# EAGLE design SilentStepStick-TMC5160_v14 (EAGLE 7.7.0)
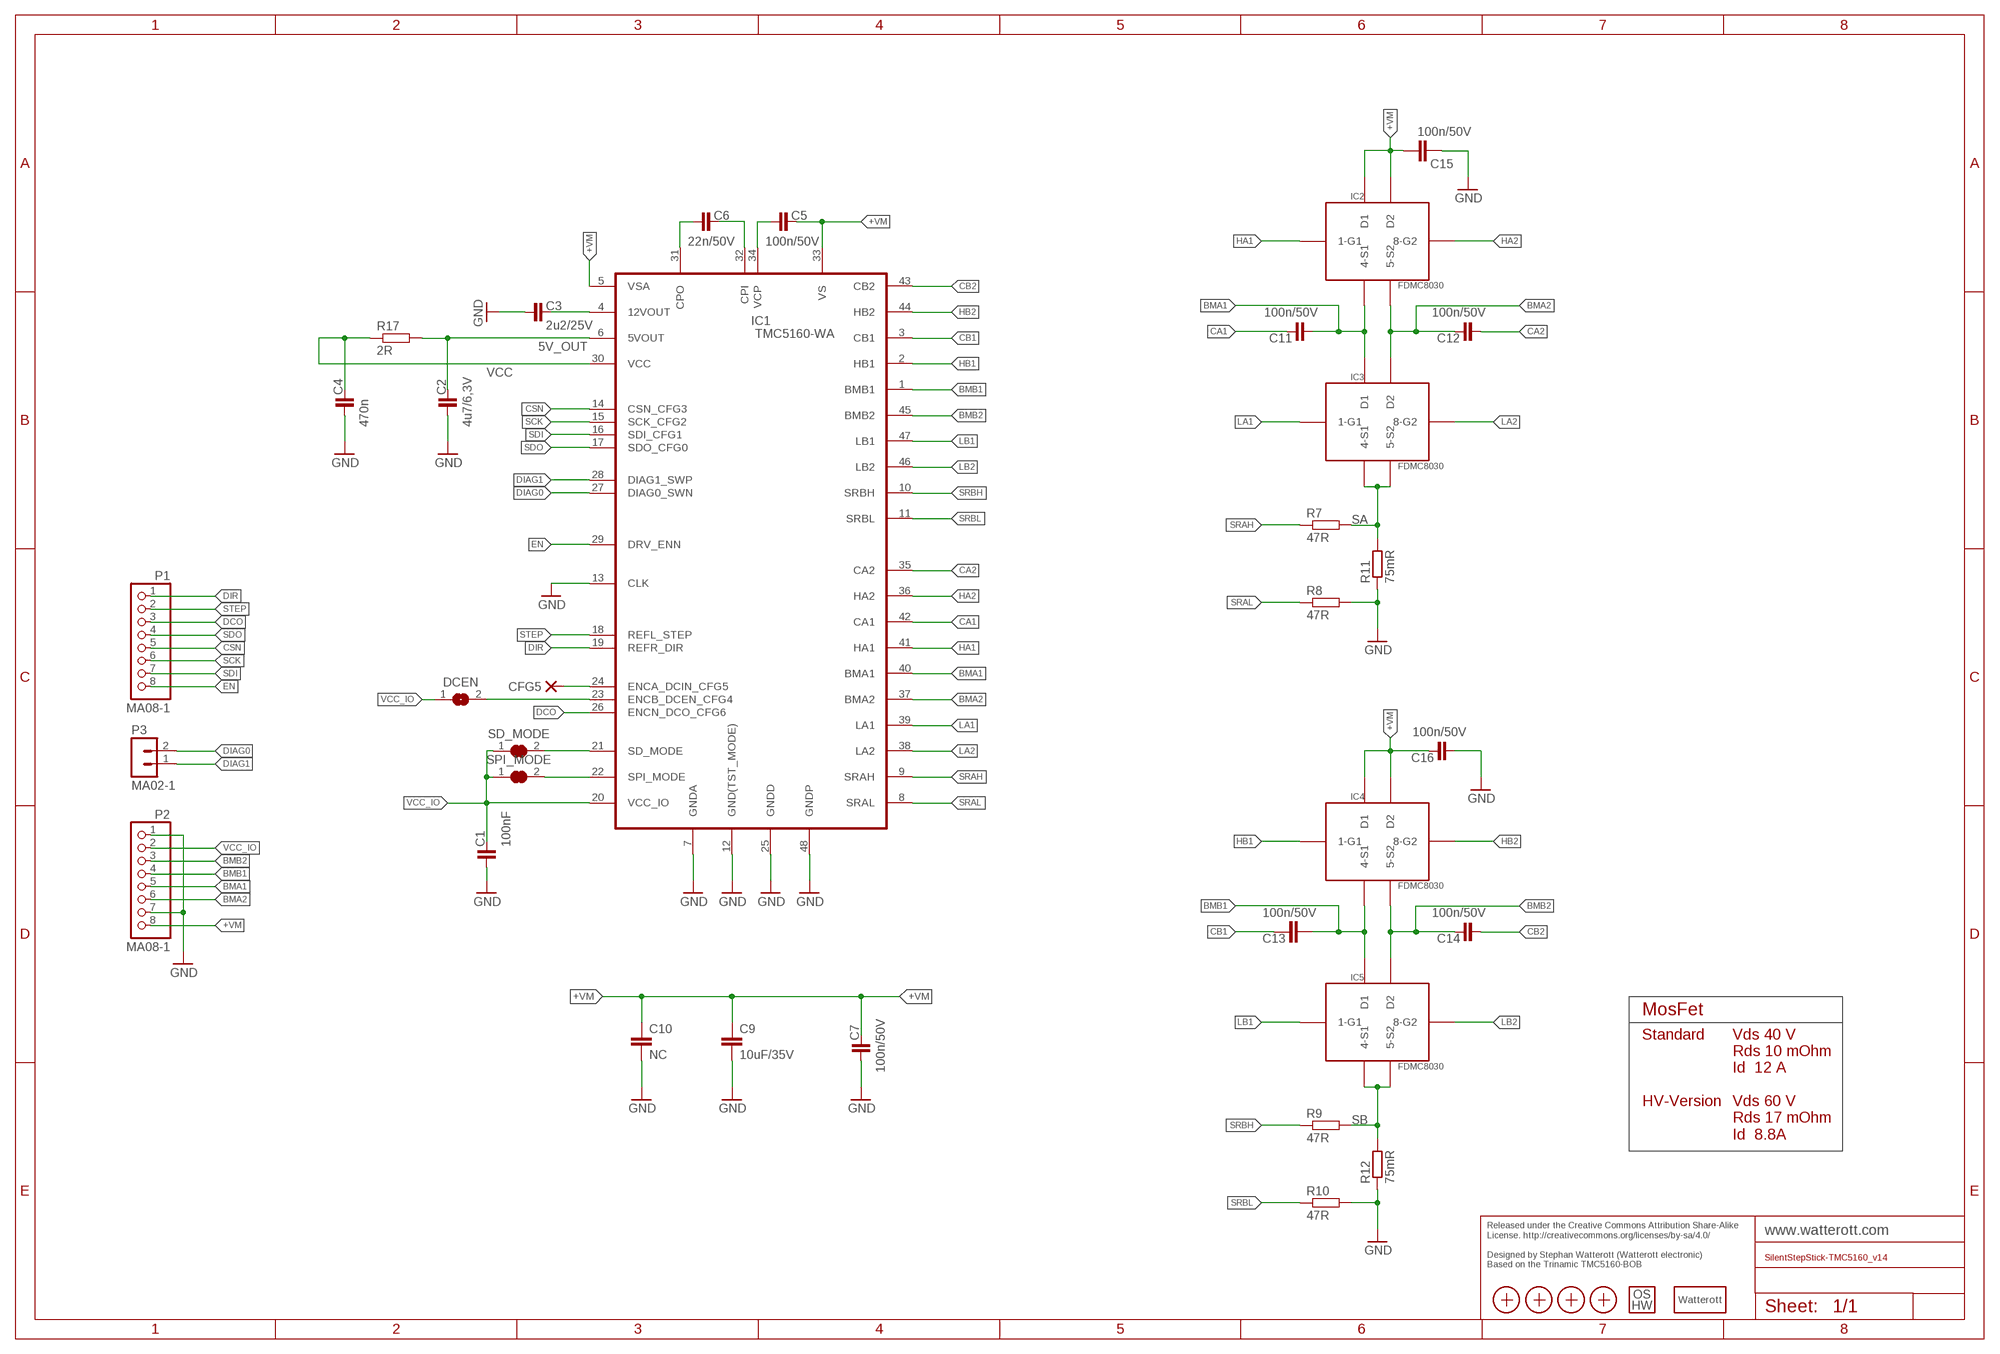
[diagram p0: schematic, sheet 1]

## Parts
C1  100nF  CAPACITOR-0402  [C0402]
C2  4u7/6,3V  CAPACITOR-0402  [C0402]
C3  2u2/25V  CAPACITOR-0402  [C0402]
C4  470n  CAPACITOR-0402  [C0402]
C5  100n/50V  CAPACITOR-0402  [C0402]
C6  22n/50V  CAPACITOR-0402  [C0402]
C7  100n/50V  CAPACITOR-0402  [C0402]
C9  10uF/35V  C-EUC0805  [C0805]
C10  NC  C-EUC0805  [C0805]
C11  100n/50V  CAPACITOR-0402  [C0402]
C12  100n/50V  CAPACITOR-0402  [C0402]
C13  100n/50V  C-EUC0402  [C0402]
C14  100n/50V  CAPACITOR-0402  [C0402]
C15  100n/50V  C-EUC0402  [C0402]
C16  100n/50V  CAPACITOR-0402  [C0402]
CFG5  PAD-0.7_NC  [PAD-0.7_NC]
DCEN  JUMPER2-0402-NC  [JUMPER2-0402_NC]
IC1  TMC5160-WA  TMC5160-WA  [VQFN56(47)_8.0X8.0X0.9MM_0.5P_EP]
IC2  FDMC8030  [8-POWERWDFN]
IC3  FDMC8030  [8-POWERWDFN]
IC4  FDMC8030  [8-POWERWDFN]
IC5  FDMC8030  [8-POWERWDFN]
LOGO1  LOGO_SPARK-2  [SPARK_2MM]
LOGO2  LOGO_OSHW-2  [OSHW_2MM]
P1  MA08-1  PINHD-1X08_2.54-S  [1X08-S]
P2  MA08-1  PINHD-1X08_2.54-S  [1X08-S]
P3  MA02-1  [MA02-1]
R7  47R  RESISTOR-0402  [C0402]
R8  47R  RESISTOR-0402  [C0402]
R9  47R  RESISTOR-0402  [C0402]
R10  47R  RESISTOR-0402  [C0402]
R11  75mR  R-EU_R1206  [R1206]
R12  75mR  R-EU_R1206  [R1206]
R17  2R  RESISTOR-0402  [C0402]
SD_MODE  JUMPER2-0402-NC  [JUMPER2-0402_NC]
SPI_MODE  JUMPER2-0402-NC  [JUMPER2-0402_NC]
X1  PASSER-04  [PASSER_04MM]
X2  PASSER-04  [PASSER_04MM]
X3  PASSER-04  [PASSER_04MM]
X4  PASSER-04  [PASSER_04MM]

## Nets
5V_OUT: C2.2 IC1.6(5VOUT) R17.2
12VOUT: C3.2 IC1.4(12VOUT)
+VM: C5.2 C7.2 C9.1 C10.1 C15.2 C16.2 IC1.5(VSA) IC1.33(VS) IC2.P$D1(D1) IC2.P$D2(D2) IC4.P$D1(D1) IC4.P$D2(D2) P2.8
BMA1: C11.1 IC1.40(BMA1) IC2.P$4(4-S1) IC3.P$D1(D1) P2.5
BMA2: C12.2 IC1.37(BMA2) IC2.P$5(5-S2) IC3.P$D2(D2) P2.6
BMB1: C13.1 IC1.1(BMB1) IC4.P$4(4-S1) IC5.P$D1(D1) P2.4
BMB2: C14.2 IC1.45(BMB2) IC4.P$5(5-S2) IC5.P$D2(D2) P2.3
CA1: C11.2 IC1.42(CA1)
CA2: C12.1 IC1.35(CA2)
CB1: C13.2 IC1.3(CB1)
CB2: C14.1 IC1.43(CB2)
CSN: IC1.14(CSN_CFG3) P1.5
DCEN: DCEN.2 IC1.23(ENCB_DCEN_CFG4)
DCIN: CFG5.1(P) IC1.24(ENCA_DCIN_CFG5)
DCO: IC1.26(ENCN_DCO_CFG6) P1.3
DIAG0: IC1.27(DIAG0_SWN) P3.2
DIAG1: IC1.28(DIAG1_SWP) P3.1
DIR: IC1.19(REFR_DIR) P1.1
EN: IC1.29(DRV_ENN) P1.8
GND: C1.1 C2.1 C3.1 C4.1 C7.1 C9.2 C10.2 C15.1 C16.1 IC1.7(GNDA) IC1.12(GND(TST_MODE)) IC1.13(CLK) IC1.25(GNDD) IC1.48(GNDP) P2.1 P2.7 R8.2 R10.2 R11.1 R12.1
HA1: IC1.41(HA1) IC2.P$1(1-G1)
HA2: IC1.36(HA2) IC2.P$8(8-G2)
HB1: IC1.2(HB1) IC4.P$1(1-G1)
HB2: IC1.44(HB2) IC4.P$8(8-G2)
LA1: IC1.39(LA1) IC3.P$1(1-G1)
LA2: IC1.38(LA2) IC3.P$8(8-G2)
LB1: IC1.47(LB1) IC5.P$1(1-G1)
LB2: IC1.46(LB2) IC5.P$8(8-G2)
N$1: C6.2 IC1.32(CPI)
N$2: C6.1 IC1.31(CPO)
N$4: C5.1 IC1.34(VCP)
SA: IC3.P$4(4-S1) IC3.P$5(5-S2) R7.2 R11.2
SB: IC5.P$4(4-S1) IC5.P$5(5-S2) R9.2 R12.2
SCK: IC1.15(SCK_CFG2) P1.6
SD_MODE: IC1.21(SD_MODE) SD_MODE.2
SDI: IC1.16(SDI_CFG1) P1.7
SDO: IC1.17(SDO_CFG0) P1.4
SPI_MODE: IC1.22(SPI_MODE) SPI_MODE.2
SRAH: IC1.9(SRAH) R7.1
SRAL: IC1.8(SRAL) R8.1
SRBH: IC1.10(SRBH) R9.1
SRBL: IC1.11(SRBL) R10.1
STEP: IC1.18(REFL_STEP) P1.2
VCC: C4.2 IC1.30(VCC) R17.1
VCC_IO: C1.2 DCEN.1 IC1.20(VCC_IO) P2.2 SD_MODE.1 SPI_MODE.1

## Notes on the sheet
- MosFet
- Standard
  
  
  
  HV-Version
- Vds 40 V
  Rds 10 mOhm
  Id  12 A
  
  Vds 60 V
  Rds 17 mOhm
  Id  8.8A
- Released under the Creative Commons Attribution Share-Alike 
  License. http://creativecommons.org/licenses/by-sa/4.0/
  
  Designed by Stephan Watterott (Watterott electronic) 
  Based on the Trinamic TMC5160-BOB

## Library data of the parts
C1-C7 C11 C12 C14 C16 = we-rcl:CAPACITOR: Capacitor ...2.2uF @ 6.3V -> 0402 ...4.7uF @ 6.3V -> 0603 ...10uF @ 16V -> 0805 ...22uF @ 25V -> 1206
C9 C10 C13 C15 = rcl:C-EU: CAPACITOR, European symbol
CFG5 = we-rcl:PAD: Pad / Test-Point
DCEN SD_MODE SPI_MODE = we-rcl:JUMPER2: 2-Pin Jumper
IC1 = TMC5160-WA:TMC5160-WA: Universal high voltage controller for two-phase bipolar stepper motor. QFN8x8 wettable; BEST-NR1: TMC5160-WA; DESCRIPTION: Universal high voltage controller for two-phase bipolar stepper motor_ QFN8x8 wettable; HERSTELLER1: TRINAMIC; HOEHE: 0_9mm; LIEFERANT: TRINAMIC
IC2-IC5 = Fairchild_By_element14_Batch_1:FDMC8030: FDMC8030 two N-Channel MOSFETs https://www.fairchildsemi.com/datasheets/FD/FDMC8030.pdf
LOGO1 = we-symbol:LOGO_SPARK: Watterott electronic Logo
LOGO2 = we-symbol:LOGO_OSHW: Open-Source-Hardware Logo
P1 P2 = pinhead-2:PINHD-1X08: PIN HEADER
P3 = we-con:MA02-1: Pin Header
R7-R10 R17 = we-rcl:RESISTOR: Resistor all kinds in 0402 and 0603
R11 R12 = rcl:R-EU_: RESISTOR, European symbol
X1-X4 = we-symbol:PASSER: Fiducial Marker

## Board
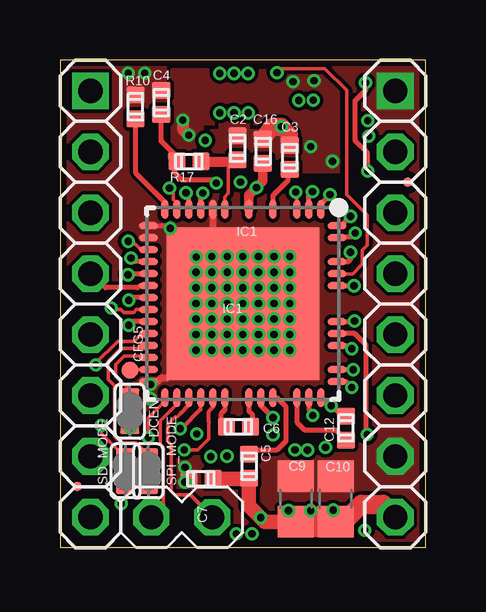
[diagram p1: board, top side]
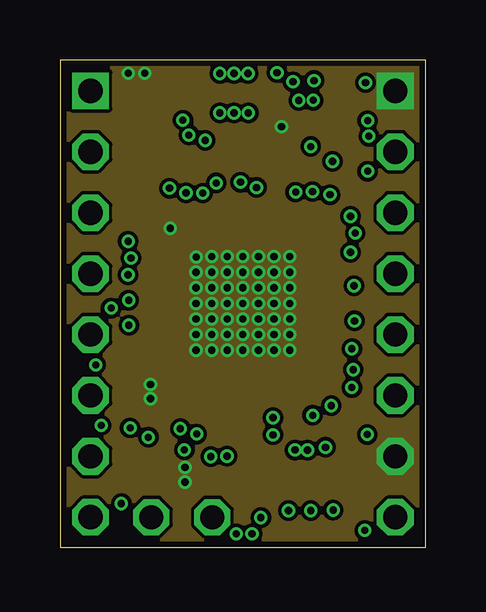
[diagram p2: board, inner layer Ground]
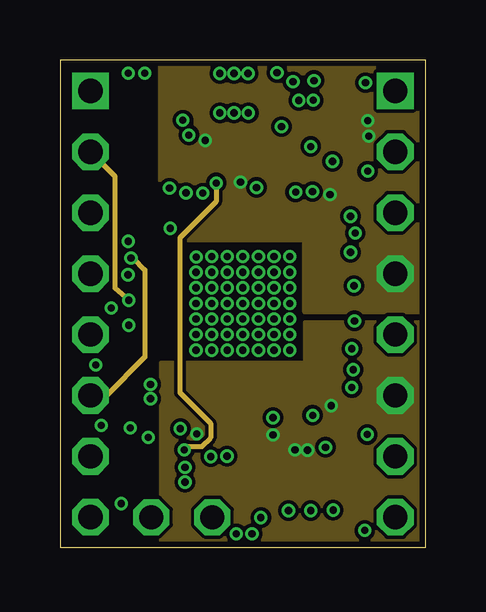
[diagram p3: board, inner layer Signal2]
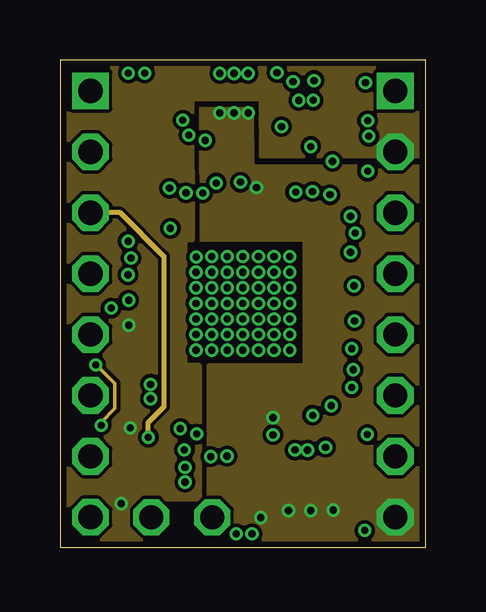
[diagram p4: board, inner layer Supply]
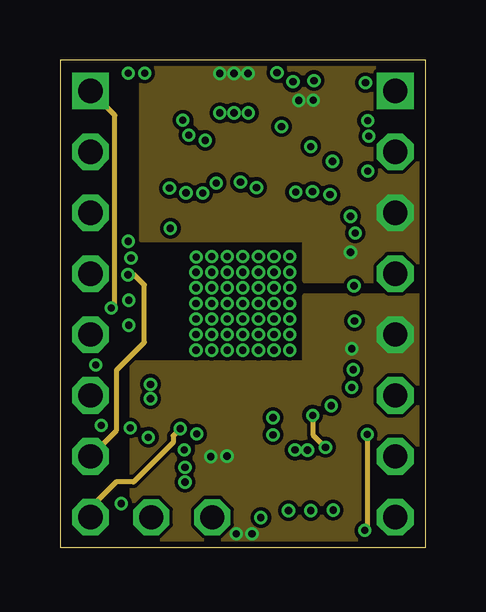
[diagram p5: board, inner layer Signal1]
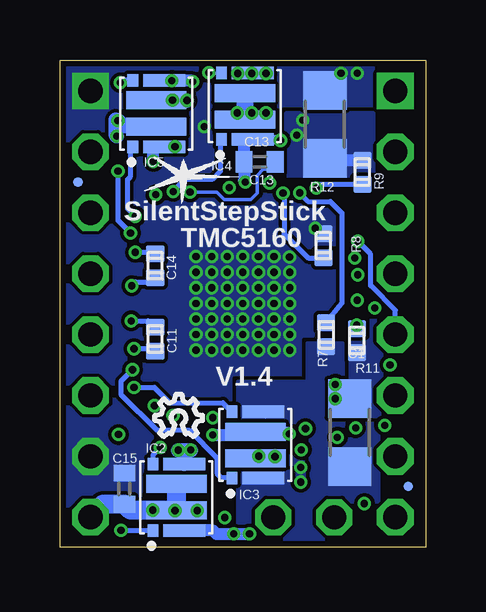
[diagram p6: board, bottom side, seen from below]

Size 15.24 x 20.32 mm. Coordinates in mm from the lower left corner, seen from the top.
Outline: 0,0 15.24,0 15.24,20.32 0,20.32 0,0
Copper layers (1+2*3+4*15+16): Top 0.018mm / dielectric 0.2mm / Ground 0.035mm / dielectric 0.36mm / Signal2 0.035mm / dielectric 0.3mm / Supply 0.035mm / dielectric 0.36mm / Signal1 0.035mm / dielectric 0.2mm / Bottom 0.018mm
Design rules "eC_6Layer_PClass6_BaseCopperO18-I35_eCDefault *": minimum track width 0.15mm, minimum drill 0.3mm, track to track 0.15mm, track to pad 0.15mm, pad to pad 0.15mm, via to via 0.15mm, smd to smd 0mil, copper to edge 0.25mm, drill to drill 0.35mm, minimum pad ring 0.175mm, minimum via ring 0.125mm, stop-mask expansion 0mil, vias tented up to drill 0.45mm, thermal gap 0.2mm

### Footprints (pad centres in the part's own frame; a part is rotated, then mirrored left to right if it is on the bottom)
C0402 = smd 0.75 x 0.7: 1 0,0.5; 2 0,-0.5
C0805 = smd 1.3 x 1.5: 1 -0.95,0; 2 0.95,0
C0402' = smd 0.7 x 0.9: 1 -0.65,0; 2 0.65,0
PAD-0.7_NC = smd 0.7 x 0.7: 1 0,0
JUMPER2-0402_NC = smd 0.8 x 0.8: 1 0,0.55; 2 0,-0.55
VQFN56(47)_8.0X8.0X0.9MM_0.5P_EP = smd 0.3 x 0.8: 1 -3.25,-3.925; 2 -2.75,-3.925; 3 -2.25,-3.925; 4 -1.25,-3.925; 5 -0.25,-3.925; 6 0.75,-3.925; 7 1.25,-3.925; 8 1.75,-3.925; 9 2.25,-3.925; 10 2.75,-3.925; 11 3.25,-3.925; 26 3.25,3.925; 27 2.75,3.925; 28 2.25,3.925; 29 1.75,3.925; 30 1.25,3.925; 31 0.75,3.925; 32 -0.25,3.925; 33 -0.75,3.925; 34 -1.25,3.925; 35 -2.25,3.925; 36 -2.75,3.925; 37 -3.25,3.925 | smd 0.8 x 0.3: 12 3.925,-3.25; 13 3.925,-2.75; 14 3.925,-2.25; 15 3.925,-1.75; 16 3.925,-1.25; 17 3.925,-0.75; 18 3.925,-0.25; 19 3.925,0.25; 20 3.925,0.75; 21 3.925,1.25; 22 3.925,1.75; 23 3.925,2.25; 24 3.925,2.75; 25 3.925,3.25; 38 -3.925,3.25; 39 -3.925,2.75; 40 -3.925,1.75; 41 -3.925,1.25; 42 -3.925,0.75; 43 -3.925,-0.75; 44 -3.925,-1.25; 45 -3.925,-1.75; 46 -3.925,-2.75; 47 -3.925,-3.25 | smd 6.35 x 6.35: 48 0,0
8-POWERWDFN = smd 0.45 x 0.52: P$1 -0.975,-1.385; P$8 -0.975,1.385 | smd 1.75 x 0.52: P$4 0.325,-1.385; P$5 0.325,1.385 | smd 2.52 x 0.75: P$D1 0,-0.55; P$D2 0,0.55
1X08-S = drill 1.016 square: 1 -8.89,0 | drill 1.016 octagon: 2 -6.35,0; 3 -3.81,0; 4 -1.27,0; 5 1.27,0; 6 3.81,0; 7 6.35,0; 8 8.89,0
MA02-1 = drill 1 octagon: 1 0,1.27; 2 0,-1.27
R1206 = smd 1.6 x 1.803: 1 -1.422,0; 2 1.422,0
PASSER_04MM = smd 0.4 x 0.4: X 0,0

### Placement (x,y rotation side)
C1  2.87,8.61 180 bottom
C2  7.39,16.65 0 top
C3  9.57,16.25 0 top
C4  4.22,18.54 0 top
C5  7.87,3.39 0 top
C6  7.44,5.02 90 top
C7  5.87,2.86 90 top
C9  9.83,2.02 90 top
C10  11.48,2.02 90 top
C11  11.27,8.68 180 bottom
C12  11.92,4.97 180 top
C13  100n/50V  [C0402']  6.92,16.07 0 bottom
C14  11.27,11.73 180 bottom
C15  100n/50V  [C0402']  12.56,2.44 270 bottom
C16  8.45,16.51 0 top
CFG5  2.92,7.39 0 top
DCEN  2.9,5.67 180 top
IC1  7.62,10.16 180 top
IC2  10.39,2.09 0 bottom
IC3  7.1,4.26 0 bottom
IC4  7.54,18.39 0 bottom
IC5  11.23,18.09 0 bottom
LOGO1  10.1,15.5 0 bottom
LOGO2  10.3,5.5 0 bottom
P1  1.27,10.14 270 top
P2  13.97,10.14 270 top
P3  5.08,1.25 270 top
R7  4.15,8.87 0 bottom
R8  4.26,12.57 180 bottom
R9  2.64,15.64 180 bottom
R10  3.15,18.37 180 top
R11  3.17,4.78 270 bottom
R12  4.2,17.63 270 bottom
R17  5.38,16.09 90 top
SD_MODE  2.73,3.17 180 top
SPI_MODE  3.68,3.17 180 top
X1  0.72,2.53 0 top
X2  14.49,15.22 0 top
X3  0.72,2.53 0 bottom
X4  14.49,15.22 0 bottom

### Tracks (layer width: path | path; a pad name or v marks a point on that pad's centre or on a via)
5V_OUT
  Top 0.15: IC1.6 6.87,14.61 7.02,14.76 7.02,16.09
  Top 0.2: 7.3,16.09 7.02,16.09 | 5.91,16.1 R17.2
  Top 0.406: R17.2 7.3,16.09 C2.2
12VOUT
  Top 0.2: 8.87,14.43 IC1.4 8.87,14.67 9.49,15.29 9.49,15.59 C3.2
+VM  (via drill 0.3)
  Top 0.2: 8.37,5.93 IC1.33 8.37,5.92 8.87,5.42 v8.87,5.4
  Top 0.4: IC1.5 7.87,14.68 v8.19,15 8.45,15.26 C16.2
  Top 0.61: C9.1 8.53,1.07 7.87,1.73 C5.2 7.75,2.86 C7.2
  Top 0.8: C10.1 11.94,1.17 C15.2 13.45,1.79 13.45,1.77 P2.8 | 9.83,1.2 C9.1 9.93,1.17
  Top 1.27: C10.1 C9.1
  Supply 0.2: 8.88,5.39 v8.87,5.4
  Bottom 0.2: v7.25,18.11 7.5,17.8 IC4.P$D1
  Bottom 0.6: IC2.P$D2 11.24,2.64 11.3,2.7
  Bottom 0.7: IC4.P$D2 IC4.P$D1
  Bottom 0.8: IC2.P$D2 IC2.P$D1 12.31,1.54 C15.2 13.45,1.79 13.45,1.77 P2.8
  other vias: 6.66,18.11 9.52,1.53 11.38,1.55 10.45,1.53 7.85,18.11 8.37,1.24
  pour Supply (no thermals): 15.25,15.9 15.25,0 4.1,0 4.1,1.6 6.2,1.6 6.2,7.6 10.2,7.6 10.2,12.8 5.9,12.8 5.88,18.29 7.98,18.29 8,15.9
BMA1  (via drill 0.3)
  Top 0.2: IC1.40 12.03,8.41 v12.16,8.28
  Signal1 0.2: v12.16,8.28 12.1,8.3
  Bottom 0.2: v12.16,8.28 11.37,8.28 C11.1
  Bottom 0.406: IC3.P$D1 6.35,3.71 v6.28,3.78
  Bottom 0.5: IC2.P$4 8.87,0.7 8.73,0.56 v7.35,0.56
  other vias: 6.96,3.8 8,0.56
  pour Signal1 (no thermals): 15.2,10.5 15.2,0 3,0 3,7.7 10.2,7.7 10.2,10.5
BMA2  (via drill 0.3)
  Top 0.2: IC1.37 v11.3,5.9 11.73,5.47 C12.2
  Bottom 0.406: IC3.P$D2 5.77,4.81 5.69,4.74 v5.69,4.72
  Bottom 0.508: v8.87,4.69 7.22,4.69 IC3.P$D2
  Bottom 0.6: v10.31,4.05 10.03,4.05 | 10.03,4.05 v9.8,4.05 | 10.03,4.05 10.03,3.51 IC2.P$5
  pour Signal2 (no thermals): 15.2,0 4.2,0 4.2,7.7 10.2,7.7 10.2,9.4 15.2,9.4
BMB1  (via drill 0.3)
  Top 0.2: IC1.1 10.87,14.32 v11.25,14.7
  Bottom 0.4: IC4.P$4 6.05,17 v6.05,16.97
  Bottom 0.5: IC4.P$4 7.57,17 C13.1 7.57,15.29 v7.52,15.22
  Bottom 0.6: 12.91,17.84 12.91,17.21 v12.87,17.14 | IC5.P$D1 12.59,17.55 v12.82,17.79
  pour Signal2 (no thermals): 15.2,20.3 15.2,9.8 10.2,9.8 10.2,12.8 4.2,12.8 4.2,20.3
BMB2  (via drill 0.3)
  Top 0.2: IC1.45 12.01,11.91 12.1,12 v12.1,12.3
  Bottom 0.2: IC4.P$5 7.26,19.73 7.3,19.7 | v12.1,12.3 11.34,12.3 C14.2
  Bottom 0.4: 7.3,19.7 v7.25,19.76 7.19,19.76 6.54,19.75
  Bottom 0.6: IC5.P$D2 v9.95,18.63
  other vias: 6.66,19.76 10.55,18.64 7.83,19.76
  pour Signal1 (no thermals): 3.4,20.3 15.2,20.3 15.2,11.1 10.2,11.1 10.2,12.8 3.4,12.8
CA1  (via drill 0.3)
  Top 0.2: IC1.42 12.24,9.41 v12.27,9.44
  Bottom 0.2: C11.2 11.46,9.33 IC1.42 11.57,9.44 v12.27,9.44
CA2
  Top 0.2: IC1.35 9.87,5.21 10.18,4.89 11.46,4.89 11.48,4.87 11.52,4.87 C12.1
CB1  (via drill 0.3)
  Top 0.15: IC1.3 9.87,14.76 v9.82,14.81
  Bottom 0.15: C13.2 6.58,15.76 6.78,15.76 7.02,15.5 7.02,14.76 7.3,14.5 8.4,14.5 8.71,14.81 v9.82,14.81
  Bottom 0.2: 6.3,16.04 C13.2 6.45,15.99
CB2  (via drill 0.3)
  Top 0.2: IC1.43 v12.24,10.91 v12.25,10.9
  Bottom 0.2: C14.1 11.25,11.06 11.39,11.06 12.09,11.06 v12.25,10.9 v12.24,10.91
CSN  (via drill 0.3)
  Top 0.15: IC1.14 3.43,12.41 3.36,12.41 3.01,12.76 v2.84,12.76
  Top 0.2: 3.43,12.41 3.43,12.43
  Bottom 0.2: v2.84,12.76 2.3,12.22 2.3,10.91 1.27,9.88 P1.5
DCEN
  Top 0.15: IC1.23 3.63,7.97 2.68,7.97 2.33,7.63 2.33,7.13
  Top 0.152: 2.33,7.13 2.93,6.53 2.93,6.25 | 2.93,6.25 2.93,6.22 | DCEN.2 2.93,6.25
DCIN
  Top 0.15: IC1.24 2.94,7.41 CFG5.1
DCO  (via drill 0.3)
  Top 0.152: IC1.26 4.32,6.18 4.32,6.03 3.68,5.4 v3.68,4.58
  Supply 0.2: v3.68,4.58 3.68,5.21 4.33,5.86 4.33,12.13 2.51,13.95 P1.3
DIAG0
  Top 0.152: 4.32,1.76 P3.2 4.31,1.75 4.31,4.17 4.18,4.3 4.18,5.27 4.87,5.95 IC1.27 4.87,5.93
  Top 0.16: 4,1.44 P3.2
DIAG1
  Top 0.152: 5.42,2.18 4.78,2.18 4.64,2.33 4.64,4.27 4.49,4.42 4.49,5.12 4.8,5.44 4.89,5.44 5.03,5.58
  Top 0.16: P3.1 5.42,2.18 | IC1.28 5.37,5.93 5.03,5.58
DIR  (via drill 0.3)
  Top 0.152: v2.13,9.97 2.19,9.91 2.54,9.91 2.65,9.8 3.07,9.8 3.18,9.91 IC1.19
  Signal1 0.2: P1.1 2.29,18.01 2.29,10 2.21,10.05 v2.13,9.97
EN  (via drill 0.3)
  Top 0.16: IC1.29 5.85,6.22 5.85,5.92 5.85,5.74 5.05,4.94 v5.01,4.94
  Signal1 0.2: v5.01,4.94 4.72,4.65 4.72,4.36 3.07,2.72 2.34,2.72 1.27,1.65 P1.8
GND  (via drill 0.3)
  Top 0.2: 4.7,7.3 4.75,7.3 v5.67,8.22 | IC1.12 4.49,13.41 v4.6,13.3 | C9.2 9.27,2.41
  Top 0.3: IC1.7 6.37,12.17 v6.32,12.12 | IC1.25 4.08,6.91 4.24,7.07 4.47,7.07 4.7,7.3
  Top 0.5: C3.1 9.57,17.19
  Top 0.7: 9.57,17.19 9.27,17.49 8.78,17.49 C16.1 8.83,17.54 v9.23,17.54
  Bottom 0.152: R11.1 v3.77,6.19
  Bottom 0.2: R8.2 4.6,13.22 v4.6,13.3
  other vias: 7.62,10.17 8.27,10.17 8.92,10.17 5.67,10.17 6.32,10.17 6.97,10.17 6.32,10.82 6.97,10.82 7.62,10.82 8.27,10.82 8.92,10.82 9.57,10.82 6.32,11.47 6.97,11.47 7.62,11.47 8.27,11.47 8.92,11.47 6.97,12.12 8.27,12.12 9.57,12.12 5.67,9.52 6.32,9.52 6.97,9.52 7.62,9.52 8.27,9.52 8.92,9.52 9.57,9.52 6.32,8.87 6.97,8.87 7.62,8.87 8.27,8.87 8.92,8.87 9.57,8.87 8.27,8.22 9.57,8.22 6.32,8.22 6.97,8.22 7.62,8.22 8.92,8.22 9.57,10.17 9.57,11.47 8.92,12.12 7.62,12.12 5.67,11.47 5.67,10.82 3.53,19.77 5.67,8.87 3.77,6.79 2.85,19.77 5.68,12.1 5.21,3.34 5.21,2.72
  pour Ground (no thermals): 0,20.32 0,0 15.24,0 15.24,20.32
  pour Top (rank 6, no thermals): 0,20.32 0,0 15.24,0 15.24,20.32
  pour Bottom (rank 6, no thermals): 0,20.32 0,0 15.24,0 15.24,20.32
HA1  (via drill 0.3)
  Top 0.2: v12.8,4.7 12.75,4.75 12.75,8.45 12.29,8.91 IC1.41 11.56,8.93
  Signal1 0.2: v12.8,4.7 12.8,0.8 v12.7,0.7
  Bottom 0.2: v12.7,0.7 IC2.P$1
HA2  (via drill 0.3)
  Top 0.2: 10.4,6.21 IC1.36 10.37,5.73 10.53,5.58 v10.53,5.5
  Signal1 0.2: v11.06,4.17 10.54,4.69 10.54,5.49 v10.53,5.5
  Bottom 0.2: IC2.P$8 11.37,3.84 v11.06,4.17
HB1  (via drill 0.3)
  Top 0.2: IC1.2 10.37,14.68 v10.52,14.83
  Bottom 0.2: IC4.P$1 8.56,16.96 8.56,15.68 8.9,15.34 10.04,15.34 10.35,15.03 10.35,15.01 v10.52,14.83
HB2  (via drill 0.3)
  Top 0.15: IC1.44 11.55,11.4 12.2,11.4 12.6,11.8 12.6,12.4 12.8,12.6 12.8,13.86 11.95,14.71 11.95,19.05 11.04,19.96 9.21,19.96 v9.04,19.79
  Bottom 0.15: IC4.P$8 9.03,19.77 v9.04,19.79
LA1  (via drill 0.3)
  Top 0.2: IC1.39 v12.21,7.41 v12.22,7.4
  Bottom 0.2: v12.22,7.4 12.7,6.92 12.7,6.37 11.22,4.89 9.86,4.89 8.68,3.71 8.68,3.05 8.52,2.88 8.09,2.88 IC3.P$1
LA2  (via drill 0.3)
  Top 0.2: IC1.38 11.91,6.91 v12.16,6.66
  Bottom 0.2: v12.16,6.66 v12.15,6.67 11.31,6.67 10.67,6.03 8.46,6.03 IC3.P$8
LB1  (via drill 0.3)
  Top 0.2: IC1.47 11.71,13.41 v12.1,13.8
  Bottom 0.2: v12.1,13.8 12.42,14.12 12.42,15.34 12.29,15.46 12.29,16.61 IC5.P$1
LB2  (via drill 0.3)
  Top 0.2: IC1.46 11.59,12.95 12.15,12.95 v12.3,13.1 | v12.82,15.68 12.82,16.43 12.29,16.96 12.29,18.63 12.3,18.63 12.73,19.06 v12.73,19.37
  Bottom 0.2: v12.3,13.1 12.82,13.62 v12.82,15.68 | IC5.P$8 12.62,19.5 v12.73,19.37
N$1
  Top 0.2: IC1.32 7.87,5.68 8,5.55 8,5.11 C6.2
N$2
  Top 0.2: IC1.31 6.87,5.72 6.7,5.55 6.7,5.11 C6.1
N$4
  Top 0.2: IC1.34 9.04,6.24 9.4,5.88 9.4,4.41 9.03,4.04 8.12,4.04 8,3.92 C5.1
N$45
  Top 0.152: 2.73,3.67 2.73,2.79
N$46
  Top 0.152: 3.68,3.66 3.68,2.65
SA
  Bottom 0.2: 6.68,5.47 IC3.P$5 6.68,5.74 | 4.14,8.21 R7.2
  pour Bottom (rank 5, no thermals): 2,5.53 2,0 7.8,0 7.8,6.9 4.9,6.9 4.9,8.5 3.49,8.5 3.49,5.53
SB  (via drill 0.3)
  Top 0.5: v5.12,17.81 5.12,17.44 v5.37,17.19
  Bottom 0.15: 4.26,16.14 4.26,16.29 4.26,16.52
  Bottom 0.2: 4.14,15.96 R12.2 4.26,16.29 | 10.95,16.65 IC5.P$4
  Bottom 0.5: 4.26,16.14 4.25,16.14 R9.2 | v11.35,16.09 11.36,16.61 11.45,16.7 IC5.P$4 | IC5.P$5 9.78,19.48 v9.71,19.41
  other vias: 10.58,19.46 10.45,16.71
  pour Top (rank 5, no thermals): 4.7,19.9 4.7,16.6 5.9,16.6 5.9,17.7 9.7,17.7 9.7,15.7 11.58,15.7 11.58,19.8
  pour Bottom (rank 5, no thermals): 2.2,18.1 2.2,15.5 5.8,15.5 5.8,18.1
SCK  (via drill 0.3)
  Top 0.2: IC1.15 3.02,11.91 v2.96,12.06
  Signal2 0.2: P1.6 1.94,6.33 3.54,7.93 3.54,11.56 3.07,12.03 v2.96,12.06
SD_MODE  (via drill 0.3)
  Top 0.152: IC1.21 3.57,8.79 3.29,8.79 3.09,8.59 2.4,8.59 1.49,7.67 v1.49,7.61 | v1.71,5.08 1.71,4.74 2.26,4.2 SD_MODE.2
  Supply 0.152: v1.49,7.61 1.52,7.61 2.29,6.84 2.29,5.78 1.71,5.21 v1.71,5.08
SDI  (via drill 0.3)
  Top 0.15: IC1.16 3.61,11.41 3.6,11.4
  Top 0.2: 3.6,11.4 3.06,11.4 v2.83,11.36
  Signal1 0.2: P1.7 2.36,4.88 2.36,7.39 3.52,8.55 3.52,10.94 3.1,11.36 v2.83,11.36
SDO
  Top 0.15: IC1.17 3.41,10.91
  Top 0.2: 3.41,10.91 3.35,10.91 3.22,10.83 1.9,10.83 P1.4
SPI_MODE
  Top 0.152: IC1.22 3.57,8.29 2.54,8.29 2.02,7.76 2.02,6.99 2.28,6.73 2.28,4.61 2.53,4.35 3.18,4.35 3.68,3.85 SPI_MODE.2
  Top 0.2: 3.65,8.45 IC1.22
SRAH  (via drill 0.3)
  Top 0.2: IC1.9 5.37,14.66 v5.25,14.78
  Bottom 0.2: v5.26,14.78 5.26,14.78 5.26,14.77 v5.26,14.77 | R7.1 3.5,10.17 3.5,13.94 3.98,14.42 4.91,14.42 v5.26,14.77 | v5.26,14.77 v5.25,14.78
SRAL  (via drill 0.3)
  Top 0.2: IC1.8 5.87,14.69 v5.95,14.77
  Bottom 0.2: v5.95,14.77 5.9,14.72 5.9,13.07 4.9,12.07 R8.1
SRBH  (via drill 0.3)
  Top 0.15: IC1.10 4.87,14.34 4.72,14.49 4.72,14.81 v4.56,14.97
  Bottom 0.2: 4.54,14.99 v4.56,14.97 4.39,15.14 R9.1
SRBL
  Top 0.2: IC1.11 4.37,14.4 3.16,15.61 3.16,17.91 R10.1
STEP  (via drill 0.3)
  Top 0.2: IC1.18 2.98,10.41 v2.86,10.3
  Signal2 0.2: v2.86,10.3 2.3,10.79 2.3,15.46 P1.2
VCC  (via drill 0.3)
  Top 0.152: v5.18,4.06 5.75,4.06 6.2,4.51 6.2,5.22
  Top 0.16: IC1.30 6.38,6.22 6.38,5.84 6.2,5.66 6.2,5.22
  Top 0.2: R17.1 4.75,16.07 4.75,15.66 5.09,15.32 6.33,15.32 v6.51,15.19 | 4.6,16.41 4.6,16.22 R17.1 | R17.1 4.73,16.42 4.22,16.93 C4.2
  Signal2 0.2: v6.51,15.19 6.51,14.41 5.01,12.91 5.01,6.44 6.27,5.17 6.27,4.56 5.91,4.2 5.32,4.2 v5.18,4.06
VCC_IO  (via drill 0.3)
  Top 0.152: SPI_MODE.1 SD_MODE.1 2.73,1.97 2.6,1.84 2.58,1.84 v2.56,1.82 | DCEN.1 2.93,5.12
  Top 0.2: IC1.20 2.99,9.41 v2.87,9.26 | 2.93,5.12 2.92,5.11 v2.92,4.98
  Supply 0.152: v2.56,1.82 2.54,1.84 | 3.02,5.08 v2.92,4.98
  Bottom 0.152: C1.2 v2.87,9.26
  pour Supply (no thermals): 15.25,20.3 15.25,16.3 8.4,16.3 8.39,18.68 5.49,18.68 5.5,12.8 5.2,12.8 5.2,7.6 5.8,7.6 5.8,2 3.7,2 3.7,0 0,0 0,20.3

### Text on the board
bPlace: SilentStepStick | TMC5160 | V1.4
Document: Dir | GND | Step | Vio | DCO | BMB2 | SDO/CFG0 | BMB1 | CSN/CFG3 | BMA1 | SCK/CFG2 | BMA2 | SDI/CFG1 | GND | EN | Vm | DIAG0 | DIAG1
Reference: Silkscreen: 22 bPlace